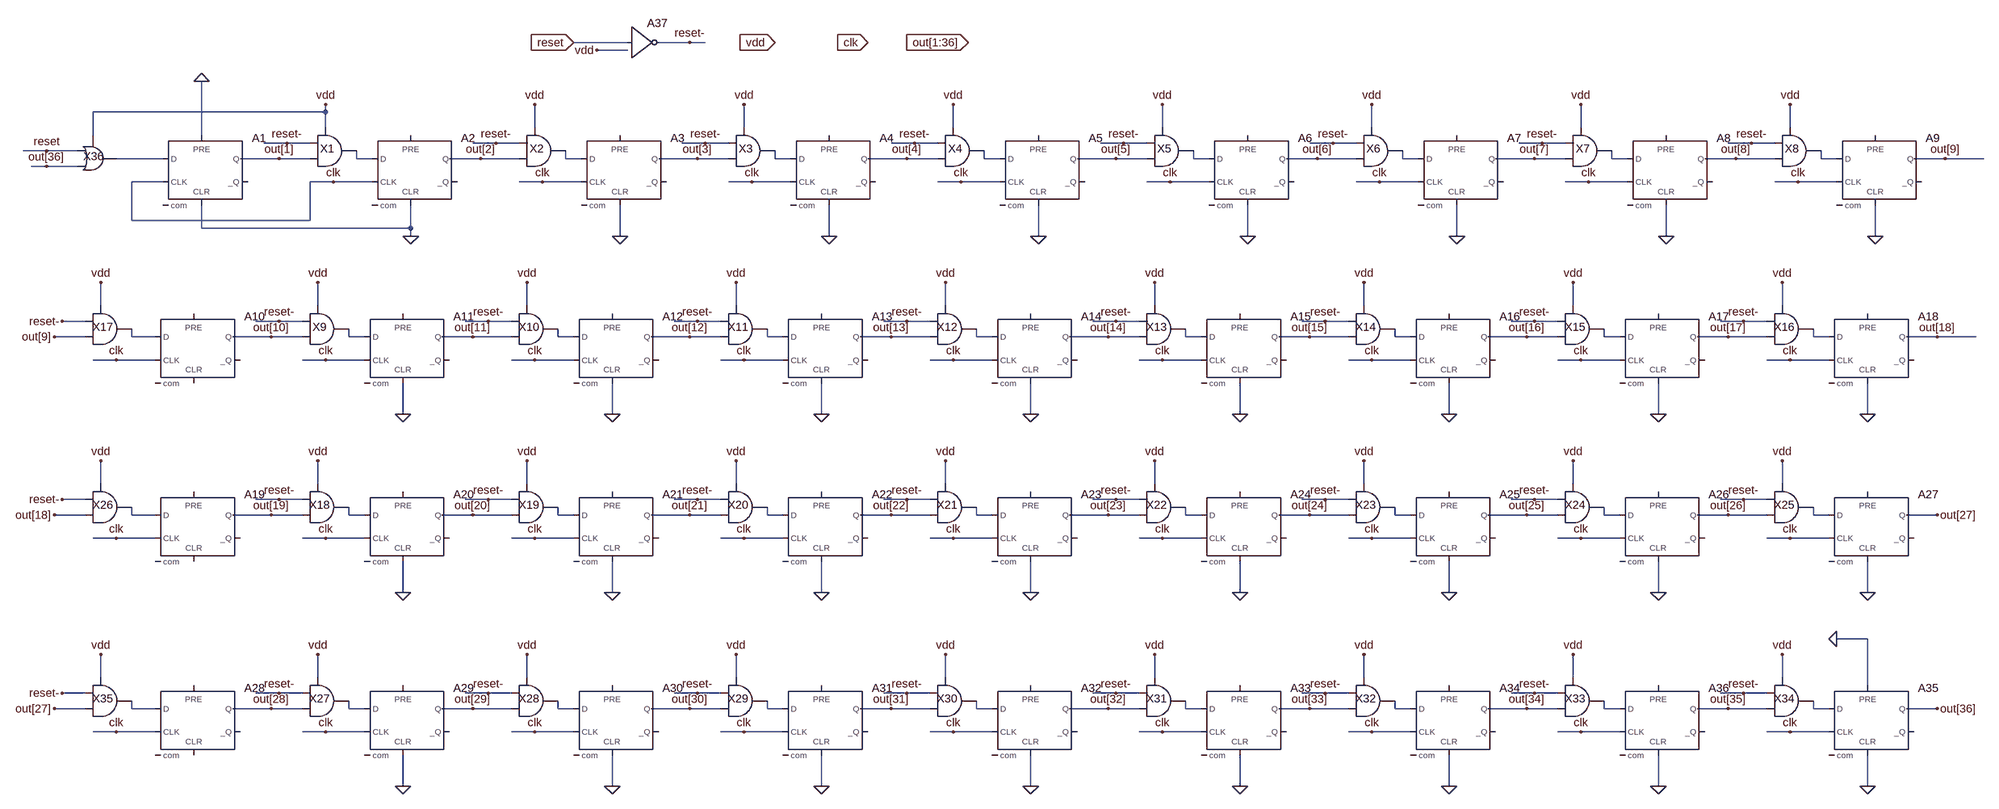
[diagram p0: schematic clkGen.asc]
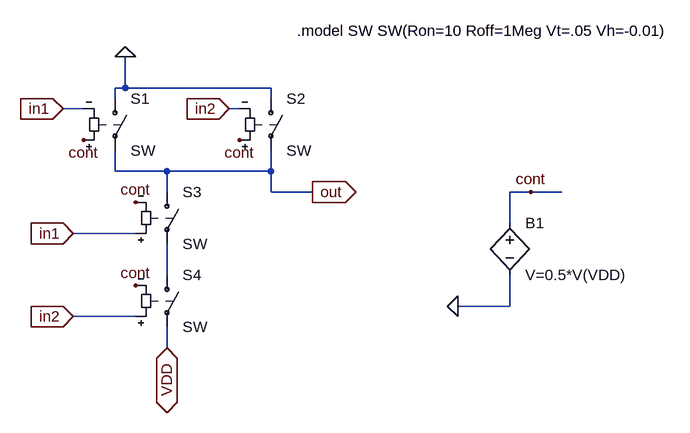
[diagram p1: sub-circuit and2.asc]
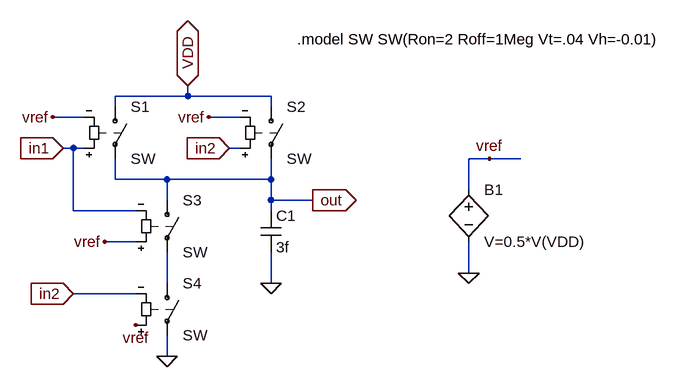
[diagram p2: sub-circuit or2.asc]
clkGen.asc, the LTspice schematic file:
Version 4
SHEET 1 3912 1428
WIRE 1104 -128 992 -128
WIRE 1232 -128 1168 -128
WIRE 1264 -128 1232 -128
WIRE 1104 -112 1040 -112
WIRE 480 16 480 0
WIRE 480 16 0 16
WIRE 480 48 480 16
WIRE 912 48 912 0
WIRE 1344 48 1344 0
WIRE 1776 48 1776 0
WIRE 2208 48 2208 0
WIRE 2640 48 2640 0
WIRE 3072 48 3072 0
WIRE 3504 48 3504 0
WIRE 0 64 0 16
WIRE 224 64 224 -48
WIRE 400 80 352 80
WIRE 448 80 400 80
WIRE 832 80 784 80
WIRE 880 80 832 80
WIRE 1264 80 1216 80
WIRE 1312 80 1264 80
WIRE 1696 80 1648 80
WIRE 1744 80 1696 80
WIRE 2128 80 2080 80
WIRE 2176 80 2128 80
WIRE 2560 80 2512 80
WIRE 2608 80 2560 80
WIRE 2992 80 2944 80
WIRE 3040 80 2992 80
WIRE 3424 80 3376 80
WIRE 3472 80 3424 80
WIRE -96 96 -144 96
WIRE -32 96 -96 96
WIRE 144 112 48 112
WIRE 384 112 304 112
WIRE 448 112 384 112
WIRE 544 112 544 96
WIRE 576 112 544 112
WIRE 800 112 736 112
WIRE 880 112 800 112
WIRE 976 112 976 96
WIRE 1008 112 976 112
WIRE 1248 112 1168 112
WIRE 1312 112 1248 112
WIRE 1408 112 1408 96
WIRE 1440 112 1408 112
WIRE 1680 112 1600 112
WIRE 1744 112 1680 112
WIRE 1840 112 1840 96
WIRE 1872 112 1840 112
WIRE 2112 112 2032 112
WIRE 2176 112 2112 112
WIRE 2272 112 2272 96
WIRE 2304 112 2272 112
WIRE 2528 112 2464 112
WIRE 2608 112 2528 112
WIRE 2704 112 2704 96
WIRE 2736 112 2704 112
WIRE 2976 112 2896 112
WIRE 3040 112 2976 112
WIRE 3136 112 3136 96
WIRE 3168 112 3136 112
WIRE 3392 112 3328 112
WIRE 3472 112 3392 112
WIRE 3568 112 3568 96
WIRE 3600 112 3568 112
WIRE 3824 112 3760 112
WIRE 3904 112 3824 112
WIRE -96 128 -128 128
WIRE -32 128 -96 128
WIRE 144 160 80 160
WIRE 496 160 448 160
WIRE 576 160 496 160
WIRE 928 160 880 160
WIRE 1008 160 928 160
WIRE 1360 160 1312 160
WIRE 1440 160 1360 160
WIRE 1792 160 1744 160
WIRE 1872 160 1792 160
WIRE 2224 160 2176 160
WIRE 2304 160 2224 160
WIRE 2656 160 2608 160
WIRE 2736 160 2656 160
WIRE 3088 160 3040 160
WIRE 3168 160 3088 160
WIRE 3520 160 3472 160
WIRE 3600 160 3520 160
WIRE 80 240 80 160
WIRE 448 240 448 160
WIRE 448 240 80 240
WIRE 224 256 224 208
WIRE 656 256 656 208
WIRE 656 256 224 256
WIRE 656 272 656 256
WIRE 1088 272 1088 208
WIRE 1520 272 1520 208
WIRE 1952 272 1952 208
WIRE 2384 272 2384 208
WIRE 2816 272 2816 208
WIRE 3248 272 3248 208
WIRE 3680 272 3680 208
WIRE 16 416 16 368
WIRE 464 416 464 368
WIRE 896 416 896 368
WIRE 1328 416 1328 368
WIRE 1760 416 1760 368
WIRE 2192 416 2192 368
WIRE 2624 416 2624 368
WIRE 3056 416 3056 368
WIRE 3488 416 3488 368
WIRE -16 448 -64 448
WIRE 384 448 336 448
WIRE 432 448 384 448
WIRE 816 448 768 448
WIRE 864 448 816 448
WIRE 1248 448 1200 448
WIRE 1296 448 1248 448
WIRE 1680 448 1632 448
WIRE 1728 448 1680 448
WIRE 2112 448 2064 448
WIRE 2160 448 2112 448
WIRE 2544 448 2496 448
WIRE 2592 448 2544 448
WIRE 2976 448 2928 448
WIRE 3024 448 2976 448
WIRE 3408 448 3360 448
WIRE 3456 448 3408 448
WIRE -16 480 -80 480
WIRE 80 480 80 464
WIRE 128 480 80 480
WIRE 368 480 288 480
WIRE 432 480 368 480
WIRE 528 480 528 464
WIRE 560 480 528 480
WIRE 784 480 720 480
WIRE 864 480 784 480
WIRE 960 480 960 464
WIRE 992 480 960 480
WIRE 1232 480 1152 480
WIRE 1296 480 1232 480
WIRE 1392 480 1392 464
WIRE 1424 480 1392 480
WIRE 1648 480 1584 480
WIRE 1728 480 1648 480
WIRE 1824 480 1824 464
WIRE 1856 480 1824 480
WIRE 2096 480 2016 480
WIRE 2160 480 2096 480
WIRE 2256 480 2256 464
WIRE 2288 480 2256 480
WIRE 2512 480 2448 480
WIRE 2592 480 2512 480
WIRE 2688 480 2688 464
WIRE 2720 480 2688 480
WIRE 2960 480 2880 480
WIRE 3024 480 2960 480
WIRE 3120 480 3120 464
WIRE 3152 480 3120 480
WIRE 3376 480 3312 480
WIRE 3456 480 3376 480
WIRE 3552 480 3552 464
WIRE 3584 480 3552 480
WIRE 3808 480 3744 480
WIRE 3888 480 3808 480
WIRE 48 528 0 528
WIRE 128 528 48 528
WIRE 480 528 432 528
WIRE 560 528 480 528
WIRE 912 528 864 528
WIRE 992 528 912 528
WIRE 1344 528 1296 528
WIRE 1424 528 1344 528
WIRE 1776 528 1728 528
WIRE 1856 528 1776 528
WIRE 2208 528 2160 528
WIRE 2288 528 2208 528
WIRE 2640 528 2592 528
WIRE 2720 528 2640 528
WIRE 3072 528 3024 528
WIRE 3152 528 3072 528
WIRE 3504 528 3456 528
WIRE 3584 528 3504 528
WIRE 640 640 640 576
WIRE 1072 640 1072 576
WIRE 1504 640 1504 576
WIRE 1936 640 1936 576
WIRE 2368 640 2368 576
WIRE 2800 640 2800 576
WIRE 3232 640 3232 576
WIRE 3664 640 3664 576
WIRE 16 784 16 736
WIRE 464 784 464 736
WIRE 896 784 896 736
WIRE 1328 784 1328 736
WIRE 1760 784 1760 736
WIRE 2192 784 2192 736
WIRE 2624 784 2624 736
WIRE 3056 784 3056 736
WIRE 3488 784 3488 736
WIRE -16 816 -64 816
WIRE 384 816 336 816
WIRE 432 816 384 816
WIRE 816 816 768 816
WIRE 864 816 816 816
WIRE 1248 816 1200 816
WIRE 1296 816 1248 816
WIRE 1680 816 1632 816
WIRE 1728 816 1680 816
WIRE 2112 816 2064 816
WIRE 2160 816 2112 816
WIRE 2544 816 2496 816
WIRE 2592 816 2544 816
WIRE 2976 816 2928 816
WIRE 3024 816 2976 816
WIRE 3408 816 3360 816
WIRE 3456 816 3408 816
WIRE -16 848 -80 848
WIRE 80 848 80 832
WIRE 128 848 80 848
WIRE 368 848 288 848
WIRE 432 848 368 848
WIRE 528 848 528 832
WIRE 560 848 528 848
WIRE 784 848 720 848
WIRE 864 848 784 848
WIRE 960 848 960 832
WIRE 992 848 960 848
WIRE 1232 848 1152 848
WIRE 1296 848 1232 848
WIRE 1392 848 1392 832
WIRE 1424 848 1392 848
WIRE 1648 848 1584 848
WIRE 1728 848 1648 848
WIRE 1824 848 1824 832
WIRE 1856 848 1824 848
WIRE 2096 848 2016 848
WIRE 2160 848 2096 848
WIRE 2256 848 2256 832
WIRE 2288 848 2256 848
WIRE 2512 848 2448 848
WIRE 2592 848 2512 848
WIRE 2688 848 2688 832
WIRE 2720 848 2688 848
WIRE 2960 848 2880 848
WIRE 3024 848 2960 848
WIRE 3120 848 3120 832
WIRE 3152 848 3120 848
WIRE 3376 848 3312 848
WIRE 3456 848 3376 848
WIRE 3552 848 3552 832
WIRE 3584 848 3552 848
WIRE 3808 848 3744 848
WIRE 48 896 0 896
WIRE 128 896 48 896
WIRE 480 896 432 896
WIRE 560 896 480 896
WIRE 912 896 864 896
WIRE 992 896 912 896
WIRE 1344 896 1296 896
WIRE 1424 896 1344 896
WIRE 1776 896 1728 896
WIRE 1856 896 1776 896
WIRE 2208 896 2160 896
WIRE 2288 896 2208 896
WIRE 2640 896 2592 896
WIRE 2720 896 2640 896
WIRE 3072 896 3024 896
WIRE 3152 896 3072 896
WIRE 3504 896 3456 896
WIRE 3584 896 3504 896
WIRE 640 1008 640 944
WIRE 1072 1008 1072 944
WIRE 1504 1008 1504 944
WIRE 1936 1008 1936 944
WIRE 2368 1008 2368 944
WIRE 2800 1008 2800 944
WIRE 3232 1008 3232 944
WIRE 3664 1008 3664 944
WIRE 3664 1104 3600 1104
WIRE 16 1184 16 1136
WIRE 464 1184 464 1136
WIRE 896 1184 896 1136
WIRE 1328 1184 1328 1136
WIRE 1760 1184 1760 1136
WIRE 2192 1184 2192 1136
WIRE 2624 1184 2624 1136
WIRE 3056 1184 3056 1136
WIRE 3488 1184 3488 1136
WIRE 3664 1200 3664 1104
WIRE -16 1216 -64 1216
WIRE 384 1216 336 1216
WIRE 432 1216 384 1216
WIRE 816 1216 768 1216
WIRE 864 1216 816 1216
WIRE 1248 1216 1200 1216
WIRE 1296 1216 1248 1216
WIRE 1680 1216 1632 1216
WIRE 1728 1216 1680 1216
WIRE 2112 1216 2064 1216
WIRE 2160 1216 2112 1216
WIRE 2544 1216 2496 1216
WIRE 2592 1216 2544 1216
WIRE 2976 1216 2928 1216
WIRE 3024 1216 2976 1216
WIRE 3408 1216 3360 1216
WIRE 3456 1216 3408 1216
WIRE -16 1248 -80 1248
WIRE 80 1248 80 1232
WIRE 128 1248 80 1248
WIRE 368 1248 288 1248
WIRE 432 1248 368 1248
WIRE 528 1248 528 1232
WIRE 560 1248 528 1248
WIRE 784 1248 720 1248
WIRE 864 1248 784 1248
WIRE 960 1248 960 1232
WIRE 992 1248 960 1248
WIRE 1232 1248 1152 1248
WIRE 1296 1248 1232 1248
WIRE 1392 1248 1392 1232
WIRE 1424 1248 1392 1248
WIRE 1648 1248 1584 1248
WIRE 1728 1248 1648 1248
WIRE 1824 1248 1824 1232
WIRE 1856 1248 1824 1248
WIRE 2096 1248 2016 1248
WIRE 2160 1248 2096 1248
WIRE 2256 1248 2256 1232
WIRE 2288 1248 2256 1248
WIRE 2512 1248 2448 1248
WIRE 2592 1248 2512 1248
WIRE 2688 1248 2688 1232
WIRE 2720 1248 2688 1248
WIRE 2960 1248 2880 1248
WIRE 3024 1248 2960 1248
WIRE 3120 1248 3120 1232
WIRE 3152 1248 3120 1248
WIRE 3376 1248 3312 1248
WIRE 3456 1248 3376 1248
WIRE 3552 1248 3552 1232
WIRE 3584 1248 3552 1248
WIRE 3808 1248 3744 1248
WIRE 48 1296 0 1296
WIRE 128 1296 48 1296
WIRE 480 1296 432 1296
WIRE 560 1296 480 1296
WIRE 912 1296 864 1296
WIRE 992 1296 912 1296
WIRE 1344 1296 1296 1296
WIRE 1424 1296 1344 1296
WIRE 1776 1296 1728 1296
WIRE 1856 1296 1776 1296
WIRE 2208 1296 2160 1296
WIRE 2288 1296 2208 1296
WIRE 2640 1296 2592 1296
WIRE 2720 1296 2640 1296
WIRE 3072 1296 3024 1296
WIRE 3152 1296 3072 1296
WIRE 3504 1296 3456 1296
WIRE 3584 1296 3504 1296
WIRE 640 1408 640 1344
WIRE 1072 1408 1072 1344
WIRE 1504 1408 1504 1344
WIRE 1936 1408 1936 1344
WIRE 2368 1408 2368 1344
WIRE 2800 1408 2800 1344
WIRE 3232 1408 3232 1344
WIRE 3664 1408 3664 1344
FLAG 400 80 reset-
FLAG 496 160 clk
FLAG 480 0 vdd
FLAG 656 272 0
FLAG 832 80 reset-
FLAG 928 160 clk
FLAG 912 0 vdd
FLAG 1088 272 0
FLAG 384 112 out[1]
FLAG 800 112 out[2]
FLAG 1264 80 reset-
FLAG 1360 160 clk
FLAG 1344 0 vdd
FLAG 1520 272 0
FLAG 1696 80 reset-
FLAG 1792 160 clk
FLAG 1776 0 vdd
FLAG 1952 272 0
FLAG 1248 112 out[3]
FLAG 2128 80 reset-
FLAG 2224 160 clk
FLAG 2208 0 vdd
FLAG 2384 272 0
FLAG 2560 80 reset-
FLAG 2656 160 clk
FLAG 2640 0 vdd
FLAG 2816 272 0
FLAG 2112 112 out[5]
FLAG 2528 112 out[6]
FLAG 2992 80 reset-
FLAG 3088 160 clk
FLAG 3072 0 vdd
FLAG 3248 272 0
FLAG 3424 80 reset-
FLAG 3520 160 clk
FLAG 3504 0 vdd
FLAG 3680 272 0
FLAG 2976 112 out[7]
FLAG 3392 112 out[8]
FLAG 384 448 reset-
FLAG 480 528 clk
FLAG 464 368 vdd
FLAG 640 640 0
FLAG 816 448 reset-
FLAG 912 528 clk
FLAG 896 368 vdd
FLAG 1072 640 0
FLAG 368 480 out[10]
FLAG 784 480 out[11]
FLAG 1248 448 reset-
FLAG 1344 528 clk
FLAG 1328 368 vdd
FLAG 1504 640 0
FLAG 1680 448 reset-
FLAG 1776 528 clk
FLAG 1760 368 vdd
FLAG 1936 640 0
FLAG 1232 480 out[12]
FLAG 1648 480 out[13]
FLAG 2112 448 reset-
FLAG 2208 528 clk
FLAG 2192 368 vdd
FLAG 2368 640 0
FLAG 2544 448 reset-
FLAG 2640 528 clk
FLAG 2624 368 vdd
FLAG 2800 640 0
FLAG 2096 480 out[14]
FLAG 2512 480 out[15]
FLAG 2976 448 reset-
FLAG 3072 528 clk
FLAG 3056 368 vdd
FLAG 3232 640 0
FLAG 3408 448 reset-
FLAG 3504 528 clk
FLAG 3488 368 vdd
FLAG 3664 640 0
FLAG 2960 480 out[16]
FLAG 3376 480 out[17]
FLAG 3824 112 out[9]
FLAG -64 448 reset-
FLAG 16 368 vdd
FLAG -80 480 out[9]
FLAG 3808 480 out[18]
FLAG 48 528 clk
FLAG 384 816 reset-
FLAG 480 896 clk
FLAG 464 736 vdd
FLAG 640 1008 0
FLAG 816 816 reset-
FLAG 912 896 clk
FLAG 896 736 vdd
FLAG 1072 1008 0
FLAG 368 848 out[19]
FLAG 784 848 out[20]
FLAG 1248 816 reset-
FLAG 1344 896 clk
FLAG 1328 736 vdd
FLAG 1504 1008 0
FLAG 1680 816 reset-
FLAG 1776 896 clk
FLAG 1760 736 vdd
FLAG 1936 1008 0
FLAG 1232 848 out[21]
FLAG 1648 848 out[22]
FLAG 2112 816 reset-
FLAG 2208 896 clk
FLAG 2192 736 vdd
FLAG 2368 1008 0
FLAG 2544 816 reset-
FLAG 2640 896 clk
FLAG 2624 736 vdd
FLAG 2800 1008 0
FLAG 2096 848 out[23]
FLAG 2512 848 out[24]
FLAG 2976 816 reset-
FLAG 3072 896 clk
FLAG 3056 736 vdd
FLAG 3232 1008 0
FLAG 3408 816 reset-
FLAG 3504 896 clk
FLAG 3488 736 vdd
FLAG 3664 1008 0
FLAG 2960 848 out[25]
FLAG 3376 848 out[26]
FLAG -64 816 reset-
FLAG 16 736 vdd
FLAG -80 848 out[18]
FLAG 3808 848 out[27]
FLAG 48 896 clk
FLAG 384 1216 reset-
FLAG 480 1296 clk
FLAG 464 1136 vdd
FLAG 640 1408 0
FLAG 816 1216 reset-
FLAG 912 1296 clk
FLAG 896 1136 vdd
FLAG 1072 1408 0
FLAG 368 1248 out[28]
FLAG 784 1248 out[29]
FLAG 1248 1216 reset-
FLAG 1344 1296 clk
FLAG 1328 1136 vdd
FLAG 1504 1408 0
FLAG 1680 1216 reset-
FLAG 1776 1296 clk
FLAG 1760 1136 vdd
FLAG 1936 1408 0
FLAG 1232 1248 out[30]
FLAG 1648 1248 out[31]
FLAG 2112 1216 reset-
FLAG 2208 1296 clk
FLAG 2192 1136 vdd
FLAG 2368 1408 0
FLAG 2544 1216 reset-
FLAG 2640 1296 clk
FLAG 2624 1136 vdd
FLAG 2800 1408 0
FLAG 2096 1248 out[32]
FLAG 2512 1248 out[33]
FLAG 2976 1216 reset-
FLAG 3072 1296 clk
FLAG 3056 1136 vdd
FLAG 3232 1408 0
FLAG 3408 1216 reset-
FLAG 3504 1296 clk
FLAG 3488 1136 vdd
FLAG 3664 1408 0
FLAG 2960 1248 out[34]
FLAG 3376 1248 out[35]
FLAG -64 1216 reset-
FLAG 16 1136 vdd
FLAG -80 1248 out[27]
FLAG 3808 1248 out[36]
FLAG 48 1296 clk
FLAG -96 128 out[36]
FLAG -96 96 reset
FLAG 992 -128 reset
IOPIN 992 -128 In
FLAG 1232 -128 reset-
FLAG 1040 -112 vdd
FLAG 1408 -128 vdd
IOPIN 1408 -128 In
FLAG 1600 -128 clk
IOPIN 1600 -128 In
FLAG 1680 -128 out[1:36]
IOPIN 1680 -128 Out
FLAG 1680 112 out[4]
FLAG 3600 1104 0
FLAG 224 -48 0
SYMBOL Digital\\dflop 224 64 R0
SYMATTR InstName A1
SYMATTR SpiceLine TRise 10p
SYMBOL and2 512 96 R0
SYMATTR InstName X1
SYMBOL and2 944 96 R0
SYMATTR InstName X2
SYMBOL and2 1376 96 R0
SYMATTR InstName X3
SYMBOL and2 1808 96 R0
SYMATTR InstName X4
SYMBOL and2 2240 96 R0
SYMATTR InstName X5
SYMBOL and2 2672 96 R0
SYMATTR InstName X6
SYMBOL and2 3104 96 R0
SYMATTR InstName X7
SYMBOL and2 3536 96 R0
SYMATTR InstName X8
SYMBOL and2 496 464 R0
SYMATTR InstName X9
SYMBOL and2 928 464 R0
SYMATTR InstName X10
SYMBOL and2 1360 464 R0
SYMATTR InstName X11
SYMBOL and2 1792 464 R0
SYMATTR InstName X12
SYMBOL and2 2224 464 R0
SYMATTR InstName X13
SYMBOL and2 2656 464 R0
SYMATTR InstName X14
SYMBOL and2 3088 464 R0
SYMATTR InstName X15
SYMBOL and2 3520 464 R0
SYMATTR InstName X16
SYMBOL and2 48 464 R0
SYMATTR InstName X17
SYMBOL and2 496 832 R0
SYMATTR InstName X18
SYMBOL and2 928 832 R0
SYMATTR InstName X19
SYMBOL and2 1360 832 R0
SYMATTR InstName X20
SYMBOL and2 1792 832 R0
SYMATTR InstName X21
SYMBOL and2 2224 832 R0
SYMATTR InstName X22
SYMBOL and2 2656 832 R0
SYMATTR InstName X23
SYMBOL and2 3088 832 R0
SYMATTR InstName X24
SYMBOL and2 3520 832 R0
SYMATTR InstName X25
SYMBOL and2 48 832 R0
SYMATTR InstName X26
SYMBOL and2 496 1232 R0
SYMATTR InstName X27
SYMBOL and2 928 1232 R0
SYMATTR InstName X28
SYMBOL and2 1360 1232 R0
SYMATTR InstName X29
SYMBOL and2 1792 1232 R0
SYMATTR InstName X30
SYMBOL and2 2224 1232 R0
SYMATTR InstName X31
SYMBOL and2 2656 1232 R0
SYMATTR InstName X32
SYMBOL and2 3088 1232 R0
SYMATTR InstName X33
SYMBOL and2 3520 1232 R0
SYMATTR InstName X34
SYMBOL and2 48 1232 R0
SYMATTR InstName X35
SYMBOL or2 48 112 R0
SYMATTR InstName X36
SYMBOL Digital\\inv 1104 -192 R0
SYMATTR InstName A37
SYMBOL Digital\\dflop 3664 1200 R0
SYMATTR InstName A35
SYMATTR SpiceLine TRise 10p
SYMBOL Digital\\dflop 656 64 R0
SYMATTR InstName A2
SYMATTR SpiceLine TRise 10p
SYMBOL Digital\\dflop 1088 64 R0
SYMATTR InstName A3
SYMATTR SpiceLine TRise 10p
SYMBOL Digital\\dflop 1520 64 R0
SYMATTR InstName A4
SYMATTR SpiceLine TRise 10p
SYMBOL Digital\\dflop 1952 64 R0
SYMATTR InstName A5
SYMATTR SpiceLine TRise 10p
SYMBOL Digital\\dflop 2384 64 R0
SYMATTR InstName A6
SYMATTR SpiceLine TRise 10p
SYMBOL Digital\\dflop 2816 64 R0
SYMATTR InstName A7
SYMATTR SpiceLine TRise 10p
SYMBOL Digital\\dflop 3248 64 R0
SYMATTR InstName A8
SYMATTR SpiceLine TRise 10p
SYMBOL Digital\\dflop 3680 64 R0
SYMATTR InstName A9
SYMATTR SpiceLine TRise 10p
SYMBOL Digital\\dflop 208 432 R0
SYMATTR InstName A10
SYMATTR SpiceLine TRise 10p
SYMBOL Digital\\dflop 640 432 R0
SYMATTR InstName A11
SYMATTR SpiceLine TRise 10p
SYMBOL Digital\\dflop 1072 432 R0
SYMATTR InstName A12
SYMATTR SpiceLine TRise 10p
SYMBOL Digital\\dflop 1504 432 R0
SYMATTR InstName A13
SYMATTR SpiceLine TRise 10p
SYMBOL Digital\\dflop 1936 432 R0
SYMATTR InstName A14
SYMATTR SpiceLine TRise 10p
SYMBOL Digital\\dflop 2368 432 R0
SYMATTR InstName A15
SYMATTR SpiceLine TRise 10p
SYMBOL Digital\\dflop 2800 432 R0
SYMATTR InstName A16
SYMATTR SpiceLine TRise 10p
SYMBOL Digital\\dflop 3232 432 R0
SYMATTR InstName A17
SYMATTR SpiceLine TRise 10p
SYMBOL Digital\\dflop 3664 432 R0
SYMATTR InstName A18
SYMATTR SpiceLine TRise 10p
SYMBOL Digital\\dflop 208 800 R0
SYMATTR InstName A19
SYMATTR SpiceLine TRise 10p
SYMBOL Digital\\dflop 640 800 R0
SYMATTR InstName A20
SYMATTR SpiceLine TRise 10p
SYMBOL Digital\\dflop 1072 800 R0
SYMATTR InstName A21
SYMATTR SpiceLine TRise 10p
SYMBOL Digital\\dflop 1504 800 R0
SYMATTR InstName A22
SYMATTR SpiceLine TRise 10p
SYMBOL Digital\\dflop 1936 800 R0
SYMATTR InstName A23
SYMATTR SpiceLine TRise 10p
SYMBOL Digital\\dflop 2368 800 R0
SYMATTR InstName A24
SYMATTR SpiceLine TRise 10p
SYMBOL Digital\\dflop 2800 800 R0
SYMATTR InstName A25
SYMATTR SpiceLine TRise 10p
SYMBOL Digital\\dflop 3232 800 R0
SYMATTR InstName A26
SYMATTR SpiceLine TRise 10p
SYMBOL Digital\\dflop 3664 800 R0
SYMATTR InstName A27
SYMATTR SpiceLine TRise 10p
SYMBOL Digital\\dflop 208 1200 R0
SYMATTR InstName A28
SYMATTR SpiceLine TRise 10p
SYMBOL Digital\\dflop 640 1200 R0
SYMATTR InstName A29
SYMATTR SpiceLine TRise 10p
SYMBOL Digital\\dflop 1072 1200 R0
SYMATTR InstName A30
SYMATTR SpiceLine TRise 10p
SYMBOL Digital\\dflop 1504 1200 R0
SYMATTR InstName A31
SYMATTR SpiceLine TRise 10p
SYMBOL Digital\\dflop 1936 1200 R0
SYMATTR InstName A32
SYMATTR SpiceLine TRise 10p
SYMBOL Digital\\dflop 2368 1200 R0
SYMATTR InstName A33
SYMATTR SpiceLine TRise 10p
SYMBOL Digital\\dflop 2800 1200 R0
SYMATTR InstName A34
SYMATTR SpiceLine TRise 10p
SYMBOL Digital\\dflop 3232 1200 R0
SYMATTR InstName A36
SYMATTR SpiceLine TRise 10p

and2.asc, the sub-circuit schematic file:
Version 4
SHEET 1 1084 680
WIRE 160 64 160 16
WIRE 160 64 144 64
WIRE 384 64 160 64
WIRE 144 80 144 64
WIRE 384 80 384 64
WIRE 96 96 64 96
WIRE 336 96 320 96
WIRE 144 192 144 160
WIRE 224 192 144 192
WIRE 384 192 384 160
WIRE 384 192 224 192
WIRE 224 224 224 192
WIRE 384 224 384 192
WIRE 448 224 384 224
WIRE 784 224 752 224
WIRE 832 224 784 224
WIRE 752 272 752 224
WIRE 176 288 80 288
WIRE 224 352 224 304
WIRE 752 400 752 352
WIRE 752 400 672 400
WIRE 176 416 80 416
WIRE 224 464 224 432
FLAG 64 96 in1
IOPIN 64 96 In
FLAG 80 288 in1
IOPIN 80 288 In
FLAG 80 416 in2
IOPIN 80 416 In
FLAG 320 96 in2
IOPIN 320 96 In
FLAG 224 464 VDD
IOPIN 224 464 BiDir
FLAG 448 224 out
IOPIN 448 224 Out
FLAG 672 400 0
FLAG 784 224 cont
FLAG 176 240 cont
FLAG 176 368 cont
FLAG 160 16 0
FLAG 96 144 cont
FLAG 336 144 cont
SYMBOL sw 144 64 R0
SYMATTR InstName S1
SYMBOL sw 384 64 R0
SYMATTR InstName S2
SYMBOL sw 224 208 R0
SYMATTR InstName S3
SYMBOL sw 224 336 R0
SYMATTR InstName S4
SYMBOL bv 752 256 R0
SYMATTR InstName B1
SYMATTR Value V=0.5*V(VDD)
TEXT 424 -24 Left 2 !.model SW SW(Ron=10 Roff=1Meg Vt=.05 Vh=-0.01)

or2.asc, the sub-circuit schematic file:
Version 4
SHEET 1 1084 680
WIRE 256 64 256 48
WIRE 256 64 144 64
WIRE 384 64 256 64
WIRE 144 80 144 64
WIRE 384 80 384 64
WIRE 96 96 48 96
WIRE 336 96 288 96
WIRE 80 144 64 144
WIRE 96 144 80 144
WIRE 336 144 320 144
WIRE 720 160 688 160
WIRE 768 160 720 160
WIRE 144 192 144 160
WIRE 224 192 144 192
WIRE 384 192 384 160
WIRE 384 192 224 192
WIRE 688 208 688 160
WIRE 224 224 224 192
WIRE 384 224 384 192
WIRE 448 224 384 224
WIRE 80 240 80 144
WIRE 176 240 80 240
WIRE 384 240 384 224
WIRE 176 288 128 288
WIRE 688 336 688 288
WIRE 224 352 224 304
WIRE 384 352 384 304
WIRE 176 368 80 368
WIRE 224 464 224 432
FLAG 224 464 0
FLAG 64 144 in1
IOPIN 64 144 In
FLAG 80 368 in2
IOPIN 80 368 In
FLAG 320 144 in2
IOPIN 320 144 In
FLAG 256 48 VDD
IOPIN 256 48 BiDir
FLAG 448 224 out
IOPIN 448 224 Out
FLAG 720 160 vref
FLAG 688 336 0
FLAG 176 416 vref
FLAG 128 288 vref
FLAG 48 96 vref
FLAG 288 96 vref
FLAG 384 352 0
SYMBOL sw 144 64 R0
SYMATTR InstName S1
SYMBOL sw 384 64 R0
SYMATTR InstName S2
SYMBOL sw 224 208 R0
SYMATTR InstName S3
SYMBOL sw 224 336 R0
SYMATTR InstName S4
SYMBOL bv 688 192 R0
SYMATTR InstName B1
SYMATTR Value V=0.5*V(VDD)
SYMBOL cap 368 240 R0
SYMATTR InstName C1
SYMATTR Value 3f
TEXT 424 -24 Left 2 !.model SW SW(Ron=2 Roff=1Meg Vt=.04 Vh=-0.01)

The netlist it stands for:
* clkGen.asc
A1 N001 0 clk 0 0 0 out[1] 0 DFLOP TRise 10p
XX1 reset- out[1] N002 vdd and2
XX2 reset- out[2] N003 vdd and2
XX3 reset- out[3] N004 vdd and2
XX4 reset- out[4] N005 vdd and2
XX5 reset- out[5] N006 vdd and2
XX6 reset- out[6] N007 vdd and2
XX7 reset- out[7] N008 vdd and2
XX8 reset- out[8] N009 vdd and2
XX9 reset- out[10] N011 vdd and2
XX10 reset- out[11] N012 vdd and2
XX11 reset- out[12] N013 vdd and2
XX12 reset- out[13] N014 vdd and2
XX13 reset- out[14] N015 vdd and2
XX14 reset- out[15] N016 vdd and2
XX15 reset- out[16] N017 vdd and2
XX16 reset- out[17] N018 vdd and2
XX17 reset- out[9] N010 vdd and2
XX18 reset- out[19] N020 vdd and2
XX19 reset- out[20] N021 vdd and2
XX20 reset- out[21] N022 vdd and2
XX21 reset- out[22] N023 vdd and2
XX22 reset- out[23] N024 vdd and2
XX23 reset- out[24] N025 vdd and2
XX24 reset- out[25] N026 vdd and2
XX25 reset- out[26] N027 vdd and2
XX26 reset- out[18] N019 vdd and2
XX27 reset- out[28] N029 vdd and2
XX28 reset- out[29] N030 vdd and2
XX29 reset- out[30] N031 vdd and2
XX30 reset- out[31] N032 vdd and2
XX31 reset- out[32] N033 vdd and2
XX32 reset- out[33] N034 vdd and2
XX33 reset- out[34] N035 vdd and2
XX34 reset- out[35] N036 vdd and2
XX35 reset- out[27] N028 vdd and2
XX36 reset out[36] N001 vdd or2
A37 reset vdd vdd vdd vdd reset- vdd vdd BUF
A35 N036 0 clk 0 0 0 out[36] 0 DFLOP TRise 10p
A2 N002 0 clk 0 0 0 out[2] 0 DFLOP TRise 10p
A3 N003 0 clk 0 0 0 out[3] 0 DFLOP TRise 10p
A4 N004 0 clk 0 0 0 out[4] 0 DFLOP TRise 10p
A5 N005 0 clk 0 0 0 out[5] 0 DFLOP TRise 10p
A6 N006 0 clk 0 0 0 out[6] 0 DFLOP TRise 10p
A7 N007 0 clk 0 0 0 out[7] 0 DFLOP TRise 10p
A8 N008 0 clk 0 0 0 out[8] 0 DFLOP TRise 10p
A9 N009 0 clk 0 0 0 out[9] 0 DFLOP TRise 10p
A10 N010 0 clk 0 0 0 out[10] 0 DFLOP TRise 10p
A11 N011 0 clk 0 0 0 out[11] 0 DFLOP TRise 10p
A12 N012 0 clk 0 0 0 out[12] 0 DFLOP TRise 10p
A13 N013 0 clk 0 0 0 out[13] 0 DFLOP TRise 10p
A14 N014 0 clk 0 0 0 out[14] 0 DFLOP TRise 10p
A15 N015 0 clk 0 0 0 out[15] 0 DFLOP TRise 10p
A16 N016 0 clk 0 0 0 out[16] 0 DFLOP TRise 10p
A17 N017 0 clk 0 0 0 out[17] 0 DFLOP TRise 10p
A18 N018 0 clk 0 0 0 out[18] 0 DFLOP TRise 10p
A19 N019 0 clk 0 0 0 out[19] 0 DFLOP TRise 10p
A20 N020 0 clk 0 0 0 out[20] 0 DFLOP TRise 10p
A21 N021 0 clk 0 0 0 out[21] 0 DFLOP TRise 10p
A22 N022 0 clk 0 0 0 out[22] 0 DFLOP TRise 10p
A23 N023 0 clk 0 0 0 out[23] 0 DFLOP TRise 10p
A24 N024 0 clk 0 0 0 out[24] 0 DFLOP TRise 10p
A25 N025 0 clk 0 0 0 out[25] 0 DFLOP TRise 10p
A26 N026 0 clk 0 0 0 out[26] 0 DFLOP TRise 10p
A27 N027 0 clk 0 0 0 out[27] 0 DFLOP TRise 10p
A28 N028 0 clk 0 0 0 out[28] 0 DFLOP TRise 10p
A29 N029 0 clk 0 0 0 out[29] 0 DFLOP TRise 10p
A30 N030 0 clk 0 0 0 out[30] 0 DFLOP TRise 10p
A31 N031 0 clk 0 0 0 out[31] 0 DFLOP TRise 10p
A32 N032 0 clk 0 0 0 out[32] 0 DFLOP TRise 10p
A33 N033 0 clk 0 0 0 out[33] 0 DFLOP TRise 10p
A34 N034 0 clk 0 0 0 out[34] 0 DFLOP TRise 10p
A36 N035 0 clk 0 0 0 out[35] 0 DFLOP TRise 10p

* block symbol definitions
.subckt and2 in1 in2 out VDD
S1 0 out cont in1 SW
S2 0 out cont in2 SW
S3 out N001 in1 cont SW
S4 N001 VDD in2 cont SW
B1 cont 0 V=0.5*V(VDD)
.model SW SW(Ron=10 Roff=1Meg Vt=.05 Vh=-0.01)
.ends and2

.subckt or2 in1 in2 out VDD
S1 VDD out in1 vref SW
S2 VDD out in2 vref SW
S3 out N001 vref in1 SW
S4 N001 0 vref in2 SW
B1 vref 0 V=0.5*V(VDD)
C1 out 0 3f
.model SW SW(Ron=2 Roff=1Meg Vt=.04 Vh=-0.01)
.ends or2

.backanno
.end